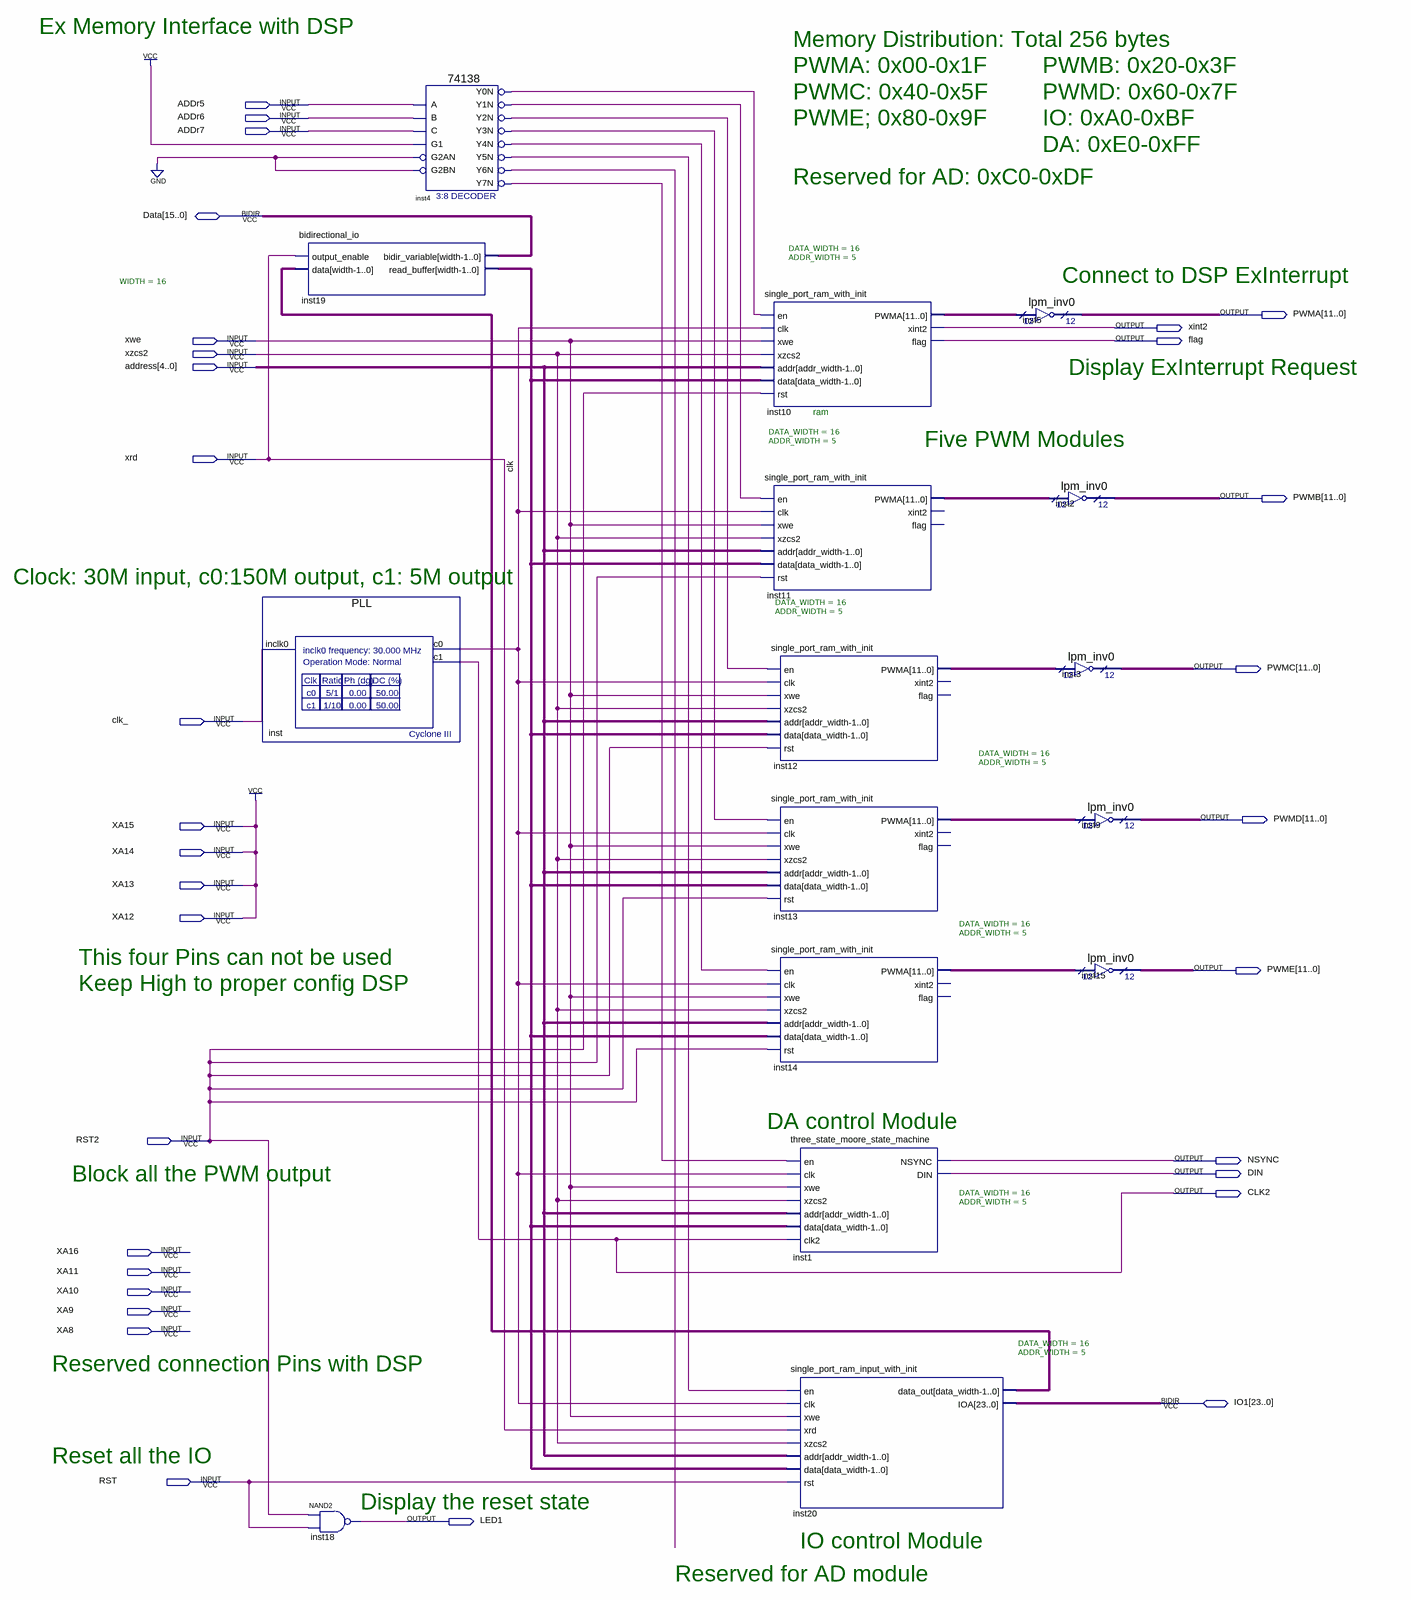
[diagram p0: schematic sheet]
// Quartus schematic 3ph.bdf as structural Verilog: 16 symbols, 32 pins
module \3ph  (
  input  ADDr5,
  input  ADDr6,
  input  ADDr7,
  input  xwe,
  input  xzcs2,
  input  [4:0] address,
  input  xrd,
  input  clk_,
  input  XA15,
  input  XA14,
  input  XA13,
  input  XA12,
  input  RST2,
  input  XA16,
  input  XA11,
  input  XA10,
  input  XA9,
  input  XA8,
  input  RST,
  inout  [15:0] Data,
  inout  [23:0] IO1,
  output [11:0] PWMA,
  output xint2,
  output flag,
  output [11:0] PWMB,
  output [11:0] PWMC,
  output [11:0] PWMD,
  output [11:0] PWME,
  output NSYNC,
  output DIN,
  output CLK2,
  output LED1
);

  wire clk, inst4_y0n, inst4_y1n, inst4_y2n, inst4_y3n, inst4_y4n, inst4_y5n, inst4_y6n, inst4_y7n;
  wire [11:0] inst10_pwma, inst11_pwma, inst12_pwma, inst13_pwma, inst14_pwma;
  wire [15:0] inst19_read_buffer, inst20_data_out;

  bidirectional_io #(.WIDTH(16)) inst19 (
    .output_enable(xrd), .data(inst20_data_out), .read_buffer(inst19_read_buffer), .bidir_variable(Data));
  PLL inst (.inclk0(clk_), .c0(clk), .c1(CLK2));
  nand inst18 (LED1, RST2, RST);
  \74138  inst4 (
    .A(ADDr5), .B(ADDr6), .G1(1'b1), .C(ADDr7), .G2AN(1'b0), .G2BN(1'b0), .Y0N(inst4_y0n), .Y1N(inst4_y1n),
    .Y2N(inst4_y2n), .Y3N(inst4_y3n), .Y4N(inst4_y4n), .Y5N(inst4_y5n), .Y6N(inst4_y6n), .Y7N(inst4_y7n));
  single_port_ram_with_init #(.DATA_WIDTH(16), .ADDR_WIDTH(5)) inst10 (
    .en(inst4_y0n), .clk(clk), .xwe(xwe), .xzcs2(xzcs2), .addr(address), .data(inst19_read_buffer),
    .rst(RST2), .PWMA(inst10_pwma), .xint2(xint2), .flag(flag));
  single_port_ram_with_init #(.DATA_WIDTH(16), .ADDR_WIDTH(5)) inst11 (
    .en(inst4_y1n), .clk(clk), .xwe(xwe), .xzcs2(xzcs2), .addr(address), .data(inst19_read_buffer),
    .rst(RST2), .PWMA(inst11_pwma));  // open: xint2, flag
  single_port_ram_with_init #(.DATA_WIDTH(16), .ADDR_WIDTH(5)) inst12 (
    .en(inst4_y2n), .clk(clk), .xwe(xwe), .xzcs2(xzcs2), .addr(address), .data(inst19_read_buffer),
    .rst(RST2), .PWMA(inst12_pwma));  // open: xint2, flag
  single_port_ram_with_init #(.DATA_WIDTH(16), .ADDR_WIDTH(5)) inst13 (
    .en(inst4_y3n), .clk(clk), .xwe(xwe), .xzcs2(xzcs2), .addr(address), .data(inst19_read_buffer),
    .rst(RST2), .PWMA(inst13_pwma));  // open: xint2, flag
  single_port_ram_with_init #(.DATA_WIDTH(16), .ADDR_WIDTH(5)) inst14 (
    .en(inst4_y4n), .clk(clk), .xwe(xwe), .xzcs2(xzcs2), .addr(address), .data(inst19_read_buffer),
    .rst(RST2), .PWMA(inst14_pwma));  // open: xint2, flag
  three_state_moore_state_machine #(.DATA_WIDTH(16), .ADDR_WIDTH(5)) inst1 (
    .en(inst4_y7n), .clk(clk), .xwe(xwe), .xzcs2(xzcs2), .addr(address), .data(inst19_read_buffer),
    .clk2(CLK2), .NSYNC(NSYNC), .DIN(DIN));
  single_port_ram_input_with_init #(.DATA_WIDTH(16), .ADDR_WIDTH(5)) inst20 (
    .en(inst4_y5n), .clk(clk), .xwe(xwe), .xrd(xrd), .xzcs2(xzcs2), .addr(address),
    .data(inst19_read_buffer), .rst(RST), .data_out(inst20_data_out), .IOA(IO1));
  lpm_inv0 inst5 (.data(inst10_pwma), .result(PWMA));
  lpm_inv0 inst2 (.data(inst11_pwma), .result(PWMB));
  lpm_inv0 inst3 (.data(inst12_pwma), .result(PWMC));
  lpm_inv0 inst9 (.data(inst13_pwma), .result(PWMD));
  lpm_inv0 inst15 (.data(inst14_pwma), .result(PWME));

  assign XA13 = XA12;
  assign XA14 = XA12;
  assign XA15 = XA12;
  // also tied to VCC on the sheet: XA12

  // Notes on the sheet:
  //   Ex Memory Interface with DSP
  //   Memory Distribution: Total 256 bytes
  //   PWMA: 0x00-0x1F
  //   PWMB: 0x20-0x3F
  //   PWMC: 0x40-0x5F
  //   PWMD: 0x60-0x7F
  //   PWME; 0x80-0x9F
  //   IO: 0xA0-0xBF
  //   DA: 0xE0-0xFF
  //   Reserved for AD: 0xC0-0xDF
  //   Connect to DSP ExInterrupt
  //   Display ExInterrupt Request
  //   ram
  //   Five PWM Modules
  //   Clock: 30M input, c0:150M output, c1: 5M output
  //   This four Pins can not be used
  //   Keep High to proper config DSP
  //   DA control Module
  //   Block all the PWM output
  //   Reserved connection Pins with DSP
  //   Reset all the IO
  //   Display the reset state
  //   IO control Module
  //   Reserved for AD module
endmodule
